# EasyEDA schematic 1-Schematic.json
TITLE: Pixie 4.3; REV: 1.0; Date: 2018-07-02; Sheet: 1/1; Drawn By: tardate
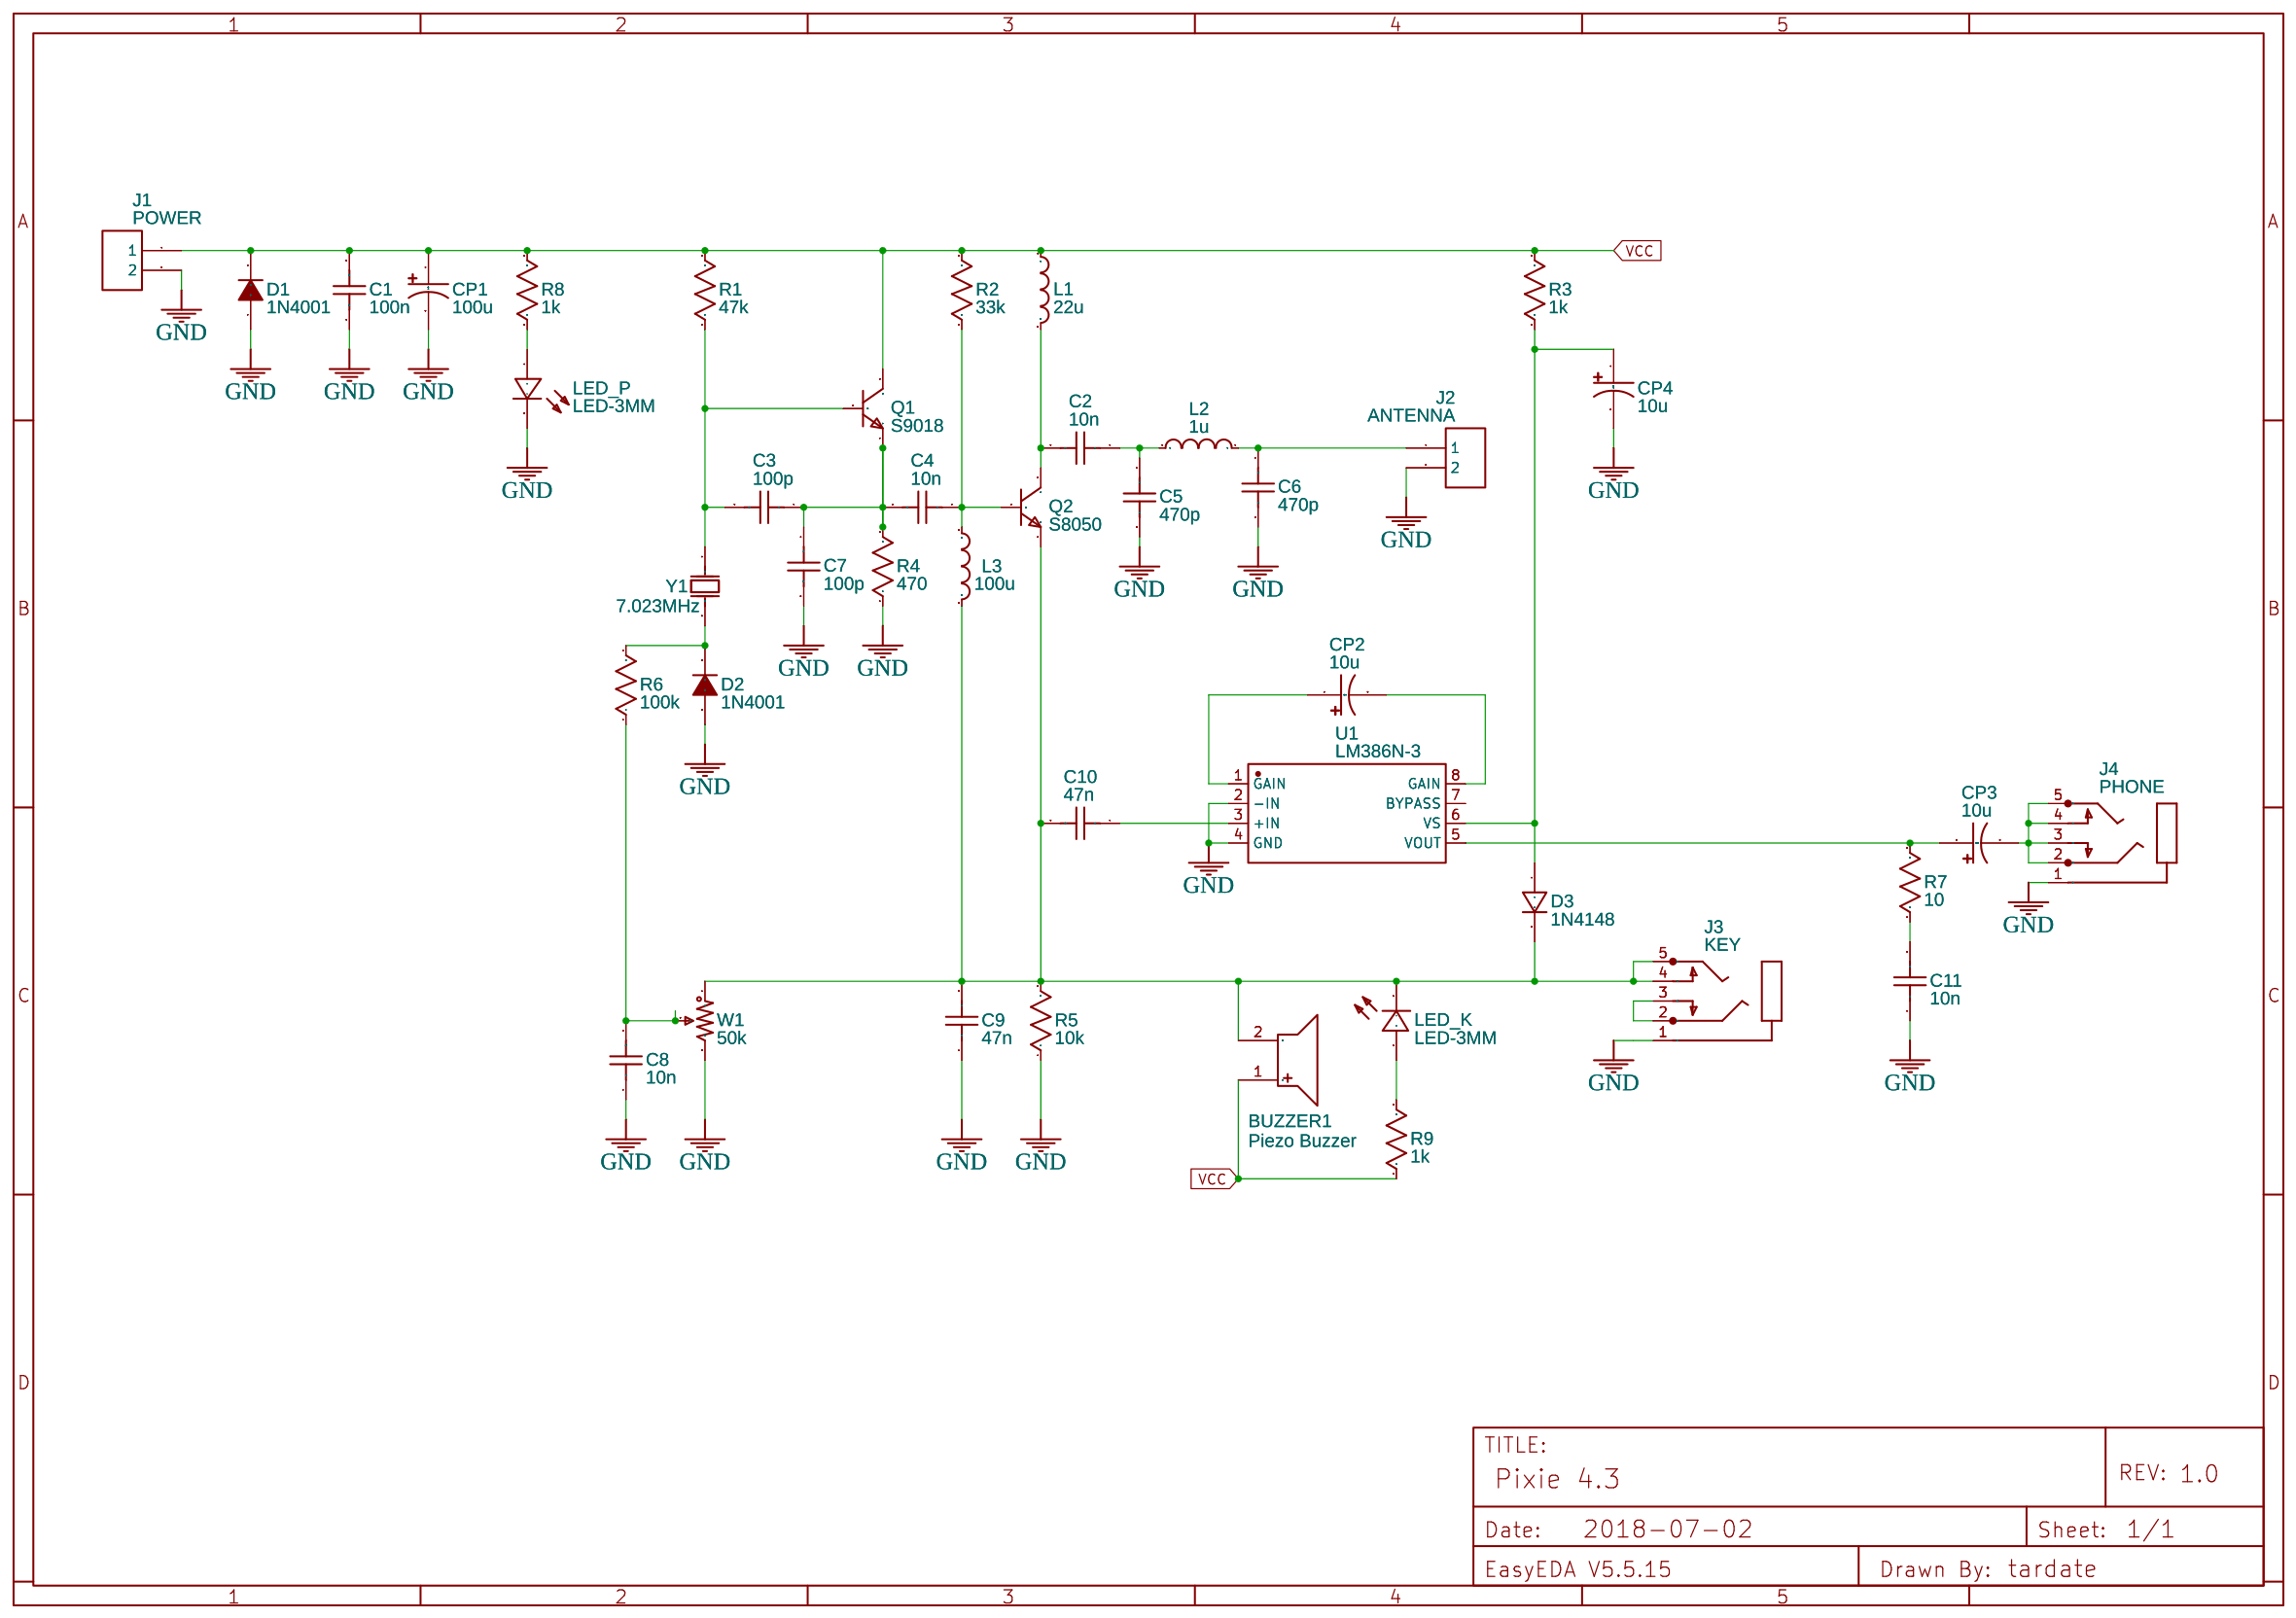
[diagram p0: schematic sheet]

## Parts
BUZZER1  Piezo Buzzer  [DIP-BUZZER-12X7.5]
C1  100n  [RAD-0.1]
C2  10n  [RAD-0.1]
C3  100p  [RAD-0.1]
C4  10n  [RAD-0.1]
C5  470p  [RAD-0.1]
C6  470p  [RAD-0.1]
C7  100p  [RAD-0.1]
C8  10n  [RAD-0.1]
C9  47n  [RAD-0.1]
C10  47n  [RAD-0.1]
C11  10n  [RAD-0.1]
CP1  100u  [CAP-D3.0XF1.5]
CP2  10u  [CAP-D3.0XF1.5]
CP3  10u  [CAP-D3.0XF1.5]
CP4  10u  [CAP-D3.0XF1.5]
D1  1N4001  [DO-41]
D2  1N4001  [DO-41]
D3  1N4148  [DO-35]
J1  POWER  [2.54-1*2P_JX]
J2  ANTENNA  [2.54-1*2P_JX]
J3  KEY  [STX3100]
J4  PHONE  [STX3100]
L1  22u  [AXIAL-0.4]
L2  1u  [AXIAL-0.4]
L3  100u  [AXIAL-0.4]
LED_K  LED-3MM  [LED-3MM/2.54]
LED_P  LED-3MM  [LED-3MM/2.54]
Q1  S9018  [TO-92(TO-92-3)]
Q2  S8050  [TO-92(TO-92-3)]
R1  47k  [AXIAL-0.3]
R2  33k  [AXIAL-0.3]
R3  1k  [AXIAL-0.3]
R4  470  [AXIAL-0.3]
R5  10k  [AXIAL-0.3]
R6  100k  [AXIAL-0.3]
R7  10  [AXIAL-0.3]
R8  1k  [AXIAL-0.3]
R9  1k  [AXIAL-0.3]
U1  LM386N-3  [DIP-8]
W1  50k  [RES-ADJ_3386P]
Y1  7.023MHz  [OSC-49S-1]

## Library data of the parts
BUZZER1 = -: Supplier: LCSC; LCSC: C96094; Manufacturer: HNDZ; Manufacturer Part: buzzerHMB1275-12B; Contributor: LCSC
C1-C11 = Cap_RAD-0.1_US: Manufacturer Part: ?
CP1-CP4 = Cap_Electrolytic(TH)_D3.0XF1.5_US: Manufacturer Part: ?
D1 D2 = -: Supplier: LCSC; LCSC: C145491; Manufacturer: VISHAY; Manufacturer Part: 1N4001-E3/73; Contributor: LCSC
D3 = -: Supplier: LCSC; Manufacturer: SEMTECH; Manufacturer Part: 1N4448; LCSC: C54037; image: //image.lceda.cn/szlcsc/C54037.jpg
J1 J2 = -: Supplier: LCSC; LCSC: C115245; Contributor: jones410; Manufacturer Part: ?
J3 J4 = -: Contributor: Adafruit; Manufacturer Part: ?
L1-L3 = Inductor_AXIAL-0.4_US: Manufacturer Part: ?
LED_K LED_P = -: Supplier: LCSC; Manufacturer: EVERLIGHT; Manufacturer Part: 204-10SURD/S530-A3; LCSC: C99772
Q1 Q2 = -: Supplier: LCSC; Manufacturer: SEMTECH; Manufacturer Part: 2N3904; LCSC: C118538
R1-R9 = Res_AXIAL-0.3(1/8W)_US: Manufacturer Part: ?
U1 = -: Supplier: LCSC; LCSC: C139428; Manufacturer: TI; Contributor: LCSC
W1 = 3386P-1-101LF_US: Supplier: LCSC; Manufacturer: Bochen; Manufacturer Part: 3386P-1-101LF; LCSC: C125022; Contributor: EasyEDA
Y1 = X49SD12MSD2SC: Supplier: LCSC; Manufacturer: YXC; LCSC: C16369

## Nets
GND: C1.1 C5.2 C6.2 C7.2 C8.1 C9.1 C11.1 CP1.2 CP4.2 D1.1(A) D2.1(A) J1.2 J2.2 J3.1 J4.1 LED_P.2(-) R4.1 R5.1 U1.2(-IN) U1.4(GND) W1.3
VCC: BUZZER1.1 C1.2 CP1.1 D1.2(K) J1.1 L1.1 Q1.3(C) R1.2 R2.2 R3.2 R8.2 R9.1
Net-(BUZZER1-2): BUZZER1.2 C9.2 C10.2 D3.2(K) J3.4 J3.5 L3.2 LED_K.2(-) Q2.1(E) R5.2 W1.1
Net-(C2-1): C2.1 C5.1 L2.1
Net-(C2-2): C2.2 L1.2 Q2.3(C)
Net-(C3-1): C3.1 C4.2 C7.1 Q1.1(E) R4.2
Net-(C3-2): C3.2 Q1.2(B) R1.1 Y1.1(OSC1)
Net-(C4-1): C4.1 L3.1 Q2.2(B) R2.1
Net-(C6-1): C6.1 J2.1 L2.2
Net-(C8-2): C8.2 R6.1 W1.2
Net-(C10-1): C10.1 U1.3(+IN)
Net-(C11-2): C11.2 R7.1
Net-(CP2-1): CP2.1 U1.1(GAIN)
Net-(CP2-2): CP2.2 U1.8(GAIN)
Net-(CP3-1): CP3.1 R7.2 U1.5(VOUT)
Net-(CP3-2): CP3.2 J4.2 J4.3 J4.4 J4.5
Net-(CP4-1): CP4.1 D3.1(A) R3.1 U1.6(VS)
Net-(D2-2): D2.2(K) R6.2 Y1.2(OSC2)
Net-(J3-2): J3.2 J3.3
Net-(LED_K-1): LED_K.1(+) R9.2
Net-(LED_P-1): LED_P.1(+) R8.1

Not connected (* = marked no-connect by the designer): U1 7(BYPASS)
